# Altium schematic sheet proy_10B_SCH_2_v1i1.SchDoc
size A
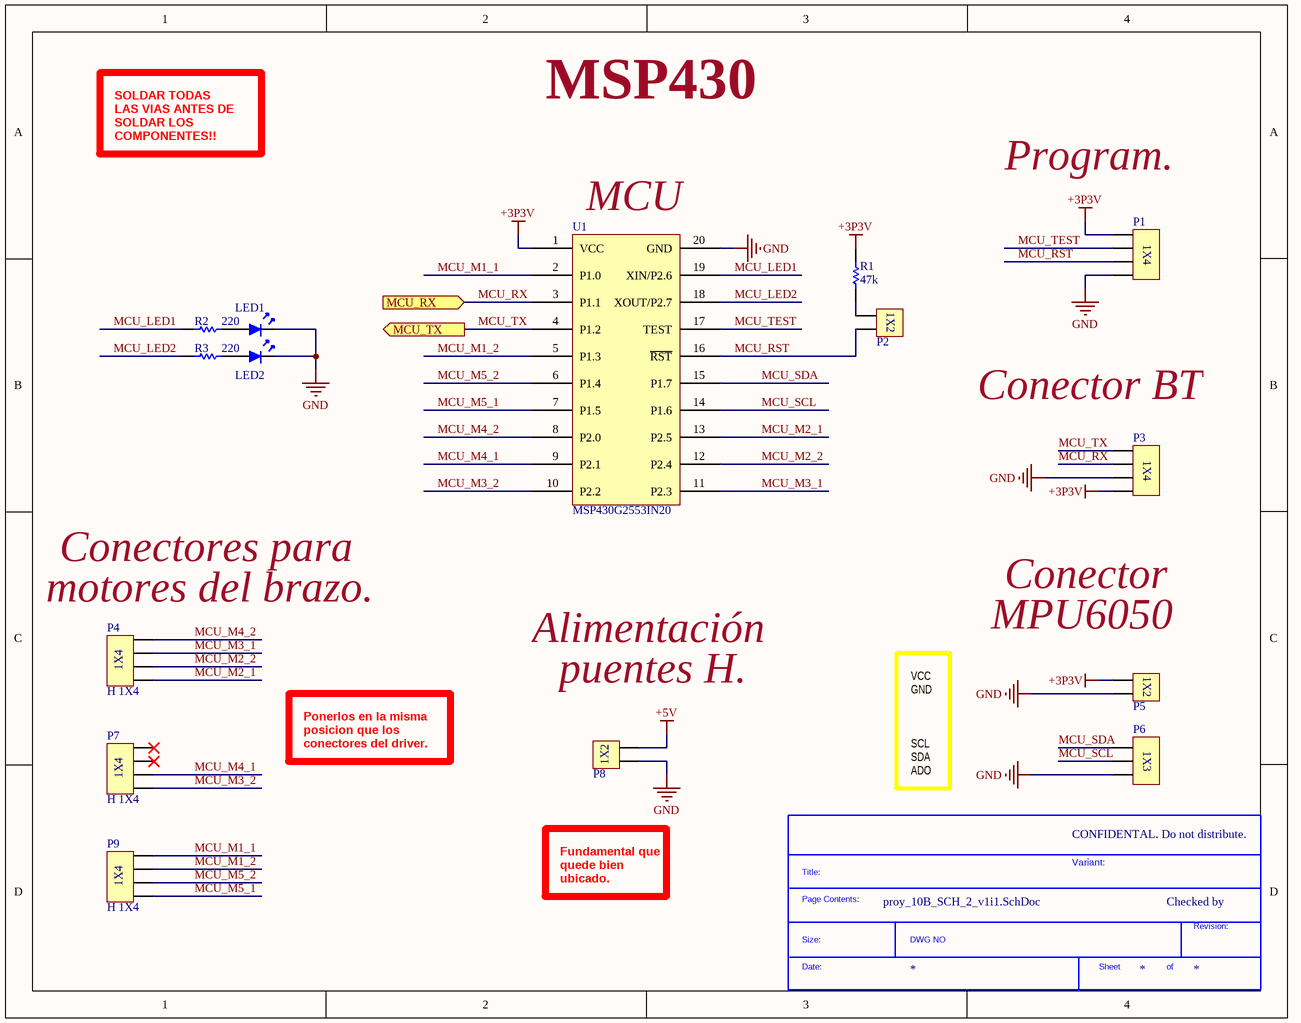
[diagram p0: proy_10B_SCH_2_v1i1.SchDoc]

## Parts
*  SDTitleBlock  (value not drawn)  (graphical)
LED1  LED  [LED 1206]  (value not drawn)
LED2  LED  [LED 1206]  (value not drawn)
P1  H 1X4  [H 1X4]  (value not drawn)
P2  H 1X2  [H 1x2]  (value not drawn)
P3  H 1X4  [H 1X4 - Hembra]  (value not drawn)
P4  H 1X4  [H 1X4]
P5  H 1X2  [H 1x2]  (value not drawn)
P6  H 1X3  [H 1x3]  (value not drawn)
P7  H 1X4  [H 1X4]
P8  H 1X2  [H 1x2 - Hembra]  (value not drawn)
P9  H 1X4  [H 1X4]
R1  47k  [R 1206]
R2  220  [R 1206]
R3  220  [R 1206]
U1  MSP430G2553IN20  [PW-20]

## Ports
MCU_RX (in), MCU_TX (out)

## Nets
+3P3V: P1.1 P3.4 P5.1 R1.2 U1.1(VCC)
+5V: P8.2
GND: LED1.2(K) LED2.2(K) P1.4 P3.3 P5.2 P6.3 P8.1 U1.20(GND)
MCU_LED1: R2.1 U1.19(XIN/P2.6)
MCU_LED2: R3.1 U1.18(XOUT/P2.7)
MCU_M1_1: P9.4 U1.2(P1.0)
MCU_M1_2: P9.3 U1.5(P1.3)
MCU_M2_1: P4.1 U1.13(P2.5)
MCU_M2_2: P4.2 U1.12(P2.4)
MCU_M3_1: P4.3 U1.11(P2.3)
MCU_M3_2: P7.1 U1.10(P2.2)
MCU_M4_1: P7.2 U1.9(P2.1)
MCU_M4_2: P4.4 U1.8(P2.0)
MCU_M5_1: P9.1 U1.7(P1.5)
MCU_M5_2: P9.2 U1.6(P1.4)
MCU_RST: P1.3 P2.2 U1.16(~{RST})
MCU_RX: P3.2 U1.3(P1.1) ; port MCU_RX
MCU_SCL: P6.2 U1.14(P1.6)
MCU_SDA: P6.1 U1.15(P1.7)
MCU_TEST: P1.2 U1.17(TEST)
MCU_TX: P3.1 U1.4(P1.2) ; port MCU_TX
NetLED1_1: LED1.1(A) R2.2
NetLED2_1: LED2.1(A) R3.2
NetP2_1: P2.1 R1.1

Not connected (* = marked no-connect by the designer): P7 3* 4*

## Notes on the sheet
- SOLDAR TODAS
  LAS VIAS ANTES DE SOLDAR LOS COMPONENTES!!
- MSP430
- (near U1) MCU
- Program.
- (near P3) Conector BT
- Conectores para
- (near P4) motores del brazo.
- (near P5) MPU6050
- Conector
- Alimentación
- puentes H.
- VCC
  GND
- Ponerlos en la misma
  posicion que los
  conectores del driver.
- SCL
  SDA
  ADO
- CONFIDENTAL. Do not distribute.
- Fundamental que
  quede bien
  ubicado.
- Variant:
- Checked by
- (in symbol H 1X2) 1X2
- (in symbol H 1X3) 1X3
- (in symbol H 1X4) 1X4
- (in symbol SDTitleBlock) Title:; Page Contents:; Revision:; Size:; DWG NO; Date:; Sheet; of

## Library data of the parts
LED1 LED2 = LED: .Creator: SR; .PCBCheck: Used; .SCHCheck: Used
P1 P3 P4 P7 P9 = H 1X4: PIN HEADER 1X4; .Creator: SR; .PCBCheck: Used; .SCHCheck: Used
P2 P5 P8 = H 1X2: PIN HEADER 1X2; .Creator: SR; .PCBCheck: Used; .SCHCheck: Used
P6 = H 1X3: PIN HEADER 1X3; .Creator: SR; .PCBCheck: Used; .SCHCheck: Used
R1-R3 = R: Resistencia; .Creator: SR; .PCBCheck: Used; .SCHCheck: Used; Category: Resistencias
U1 = MSP430G2553IN20: IC MCU 16BIT 16KB FLASH 20PDIP; Manufacturer: Texas Instruments; Core Size: 16-Bit; Speed: 16MHz; Connectivity: I²C, IrDA, LIN, SCI, SPI, UART/USART; Peripherals: Brown-out Detect/Reset, DMA, POR, PWM, WDT; Number of I /O: 16; Program Memory Size: 16KB (16K x 8); RAM Size: 512 x 8; Voltage - Supply (Vcc/Vdd): 1.8 V ~ 3.6 V; Data Converters: A/D 8x10b; Oscillator Type: Internal; .Creator: SR; Supplier 1: Digi-Key; Manufacturer Part Number: MSP430G2553IN20; RoHS: RoHS Compliant; Category: Integrated Circuits (ICs); Stock 1: 2231; Pricing 1: 1=2.79, 10=2.52, 50=2.25, 100=2.025, 250=1.8, 500=1.575, 750=1.422, 1000=1.125 (USD); Packaging: Tube; Core Processor: -; Program Memory Type: FLASH; EEPROM Size: -; Operating Temperature: -40°C ~ 85°C; Package / Case: 20-DIP (0.300", 7.62mm); ComponentLink1URL: http://www.ti.com/lit/ds/symlink/msp430g2553.pdf; ComponentLink1Description: http://www.ti.com/lit/ds/symlink/msp430g2553.pdf; Supplier Part Number 1: 296-28429-5-ND; .PCBCheck: SR; .SCHCheck: SR